# EasyEDA Pro project USB-BD v1.4_2025-09-03.epro

# Schematic 1.4
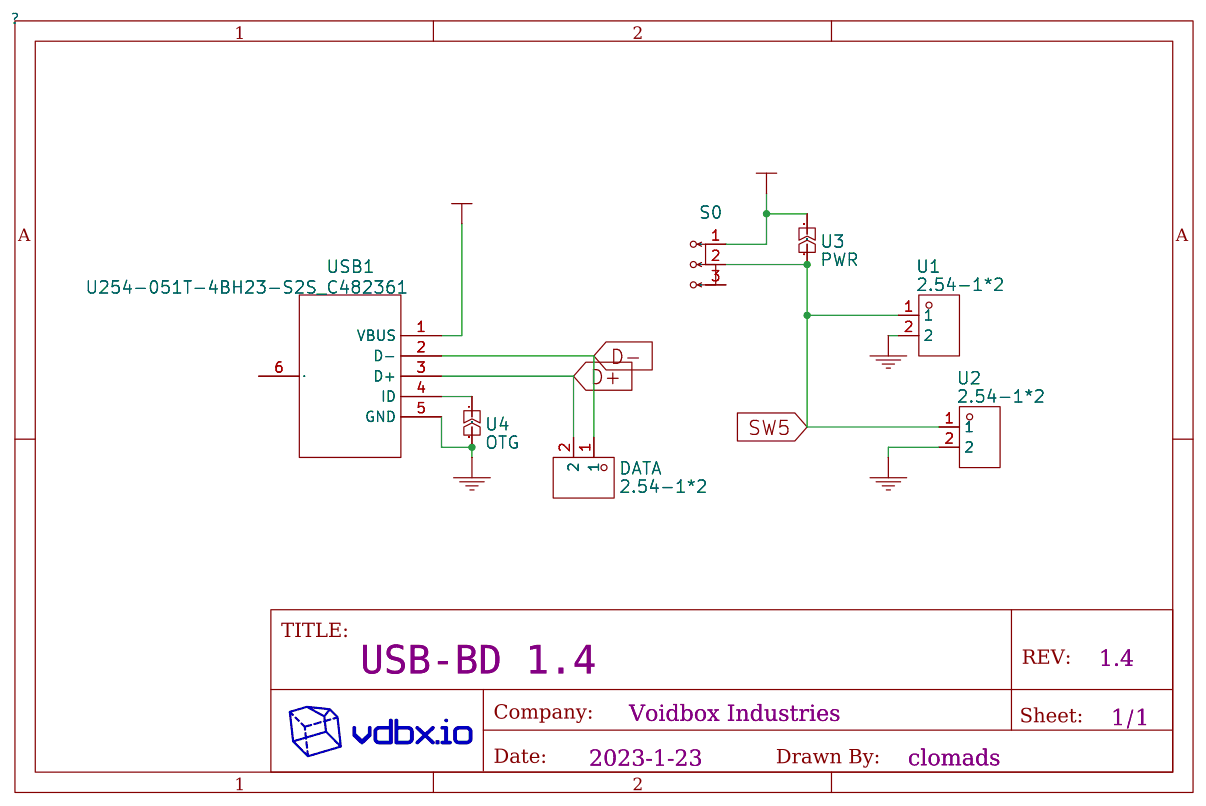
[diagram p0: schematic sheet]

## Parts
DATA  2.54-1*2  [HDR-TH_2P-P2.54-V-M]
S0  Switch  [SW-TH_DEALON_SS-12D01-GX]
U1  2.54-1*2  [HDR-TH_2P-P2.54-V-M]
U2  2.54-1*2  [HDR-TH_2P-P2.54-V-M]
U3  PWR  [JMP_ARROW_2PIN]
U4  OTG  [JMP_ARROW_2PIN]
USB1  U254-051T-4BH23-S2S_C482361  [MICRO-USB-SMD_U254-051T-4BH23-S2S]

## Library data of the parts
DATA U1 U2 = 2.54-1*2: link: https://atta.szlcsc.com/upload/public/pdf/source/20220729/DF18AADA08AA3A4F1D3B0508BB8F7248.pdf; 3DModel: HDR2.54-M-LI-1X2P; Supplier: LCSC; Supplier Part: C5116481; Manufacturer: ZHOURI(洲日); JLCPCB Part Class: Extended Part
S0 = Switch: link: https://atta.szlcsc.com/upload/public/pdf/source/20220425/25A884465C8B20C5829C01117852840B.pdf; Supplier: LCSC; Supplier Part: C2998804; Manufacturer: DEALON(德艺隆); Manufacturer Part: SS-12D01-G4; JLCPCB Part Class: Extended Part
U3 = PWR: Manufacturer Part: SOLDERING JUMPER
U4 = OTG: Manufacturer Part: SOLDERING JUMPER
USB1 = U254-051T-4BH23-S2S_C482361: link: https://item.szlcsc.com/490287.html; Supplier: LCSC; Supplier Part: C482361; Manufacturer: XKB Connectivity(中国星坤); Manufacturer Part: U254-051T-4BH23-S2S; JLCPCB Part Class: Extended Part

## Nets
+5V: S0.1 U3.1 USB1.1(VBUS)
GND: U1.2 U2.2 U4.2 USB1.5(GND)
D+: DATA.2 USB1.3(D+)
D-: DATA.1 USB1.2(D-)
SW5: S0.2 U1.1 U2.1 U3.2
Net-(U4-1): U4.1 USB1.4(ID)

Not connected (* = marked no-connect by the designer): S0 3; USB1 6(EH)

# Schematic USB-BD OG
Board Name: USB-BD OG; Create Date: 2023-01-23; Page Name: VDBX//USB-BD copy; Project Name: USB-BD 2023.2; Schematic Name: USB-BD OG; Update Date: 2023-01-23; Add into BOM: yes; Convert to PCB: yes; Date: 2018-04-12; Draw By: clomads; REV: 1.0a; Sheet: 1/1
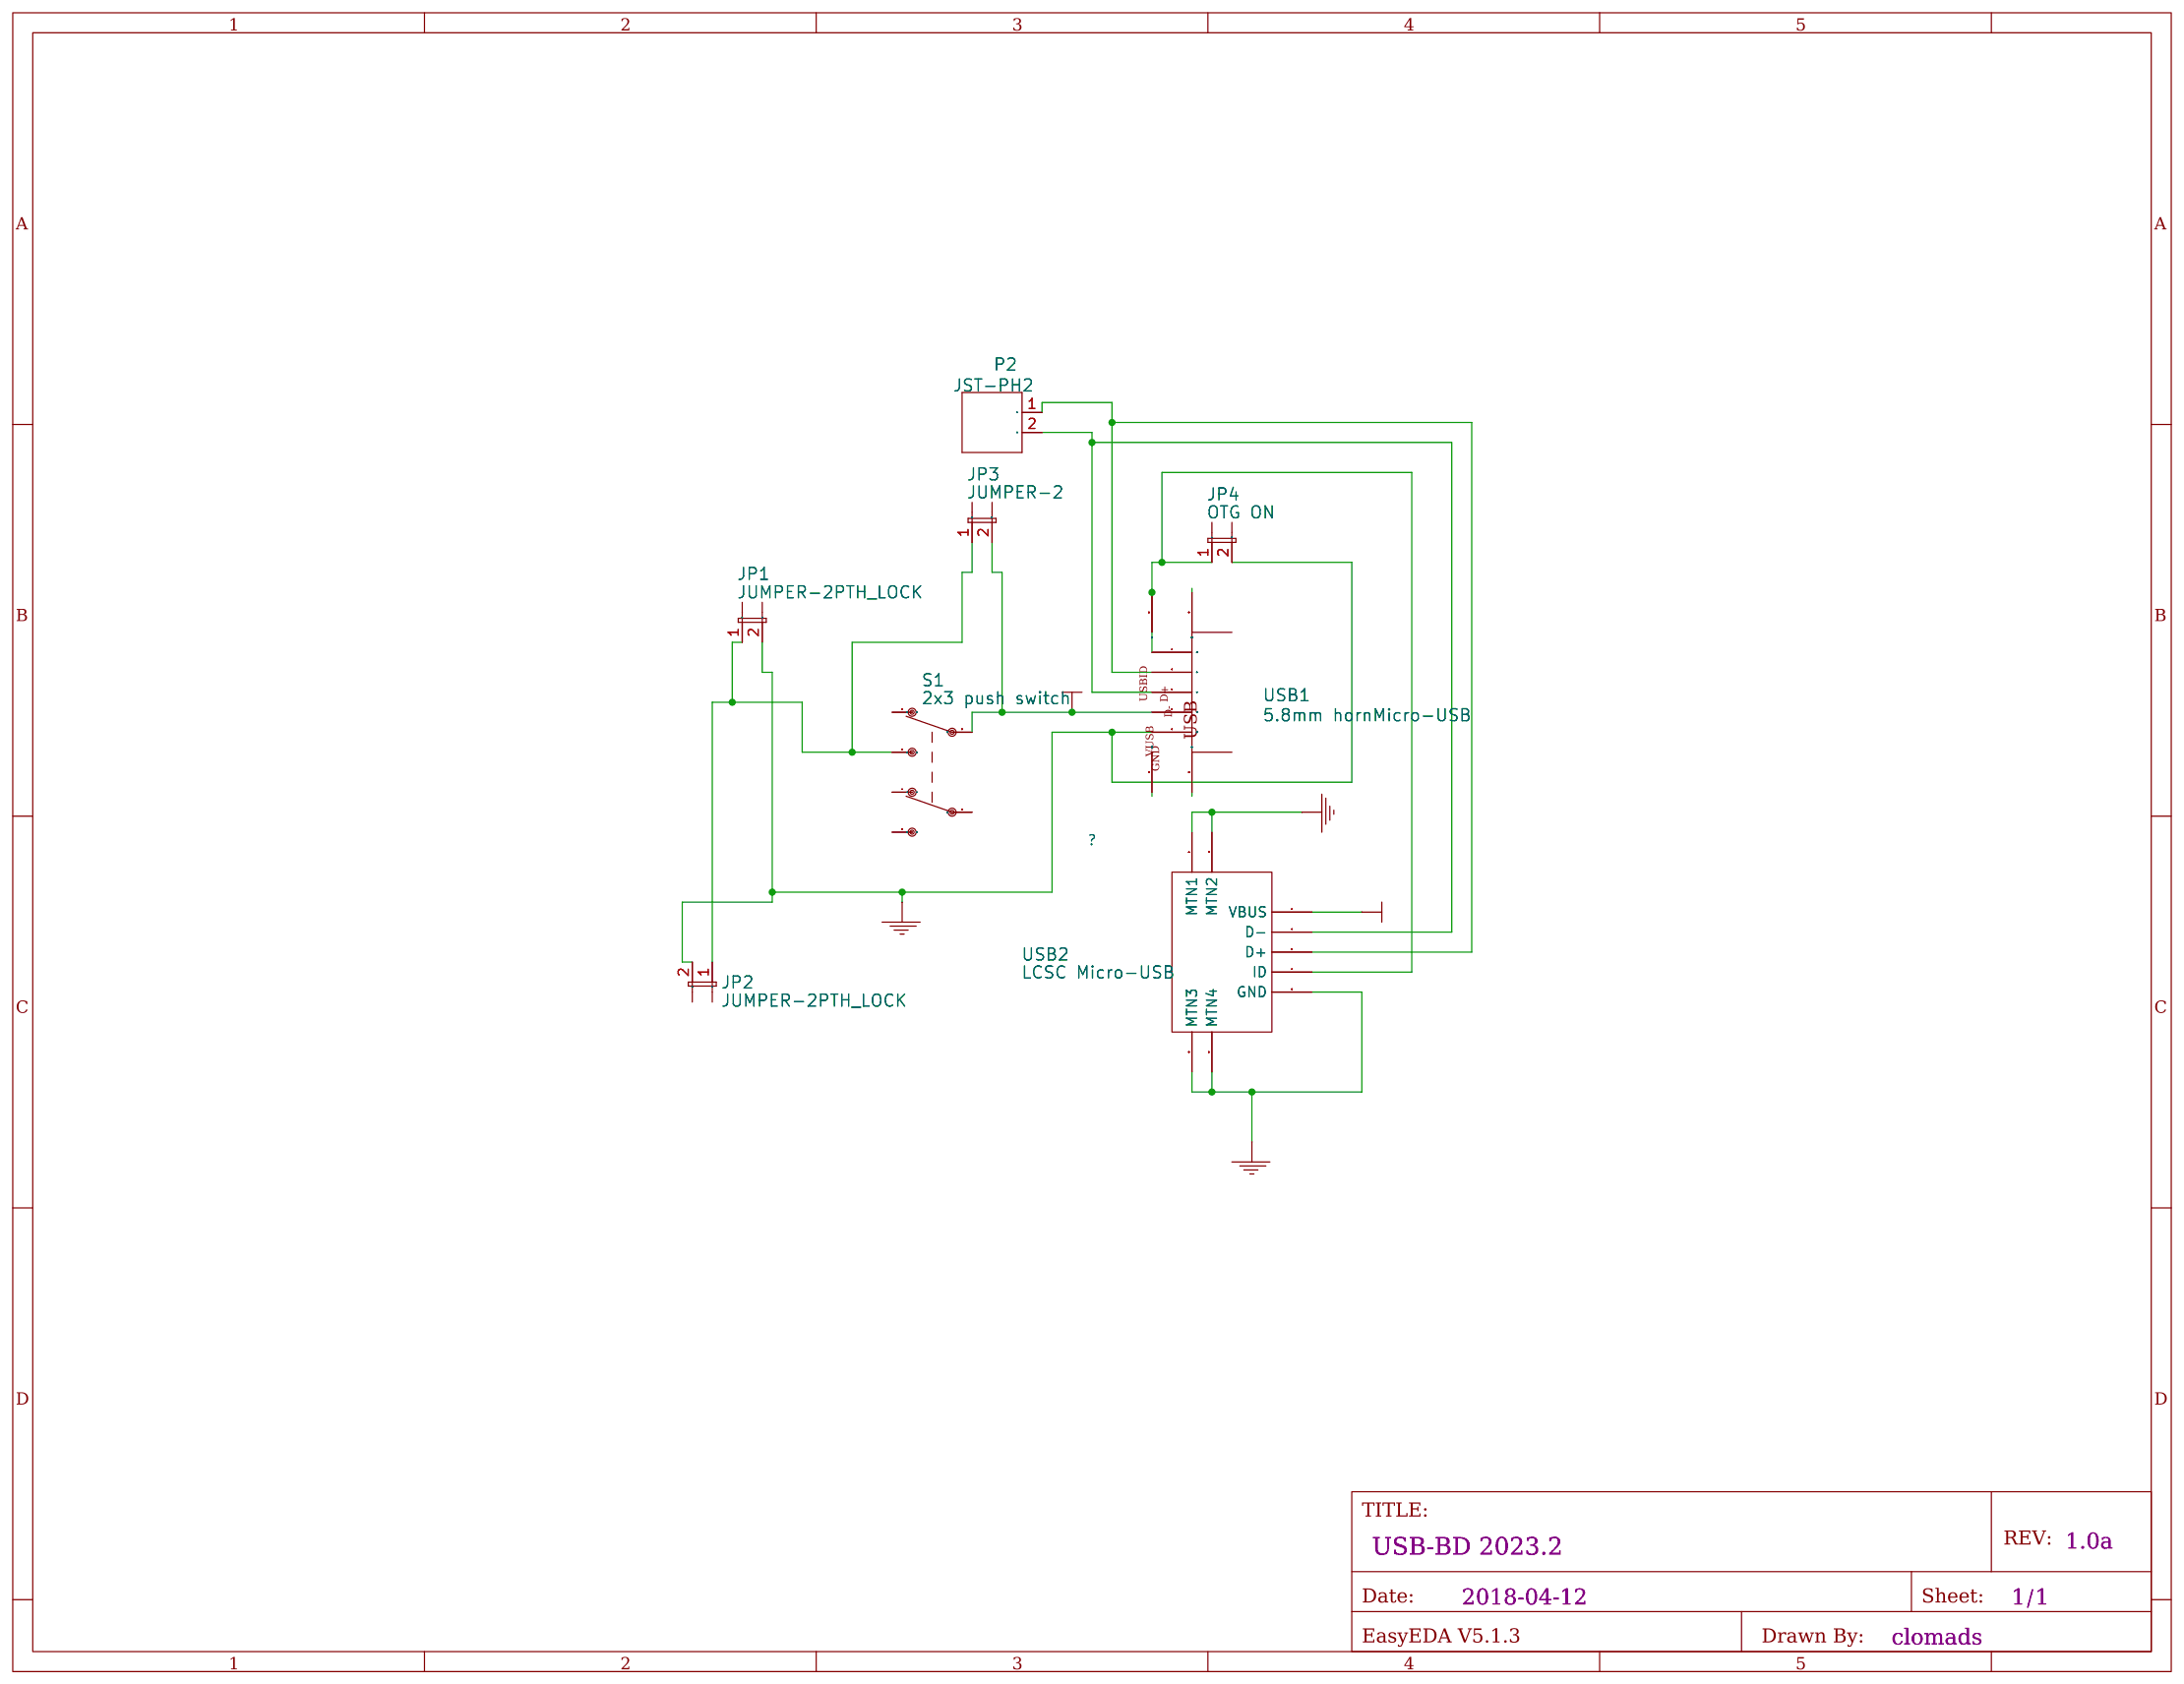
[diagram p1: schematic sheet]

## Parts
JP1  JUMPER-2PTH_LOCK  [1X02_LOCK]
JP2  JUMPER-2PTH_LOCK  [1X02_LOCK]
JP3  JUMPER-2  [JUMPER-2P]
JP4  OTG ON  [JUMPER-2P]
P2  JST-PH2  [JST-2.0-REVERSE POLARITY]
S1  2x3 push switch  [2X3 5.8MM PUSH TACT]
USB1  5.8mm hornMicro-USB  [MICRO USB 5.9]
USB2  LCSC Micro-USB

## Library data of the parts
JP1-JP4 P2 S1 USB1 = ?
USB2 = micro USBFemale: Supplier: LCSC; Manufacturer: ValuePro; image: //image.lceda.cn/szlcsc/C10418.jpg; Supplier Part: C10418

## Nets
+5V: JP3.2 S1.3 USB1.1(VUSB) USB2.1(VBUS)
GND: JP1.2 JP2.2 JP4.1 JP4.2 USB1.0(BODY) USB1.4(USBID) USB1.5(GND) USB2.0(MTN1) USB2.4(ID) USB2.5(GND)
Net-(P2-1): P2.1 USB1.3(D+) USB2.3(D+)
Net-(P2-2): P2.2 USB1.2(D-) USB2.2(D-)
S1_2: JP1.1 JP2.1 JP3.1 S1.2

Not connected (* = marked no-connect by the designer): S1 1 4 5 6

# Board 1.4
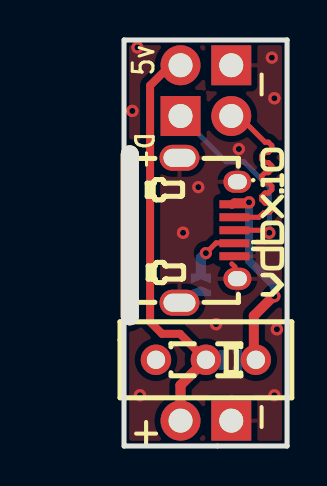
[diagram p2: board, top side]
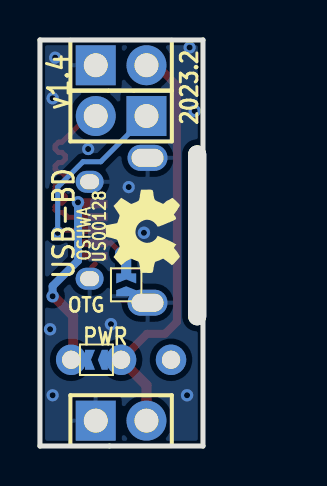
[diagram p3: board, bottom side, seen from below]

Outline 8.16 x 20.31 mm; copper layers: Top Layer, Bottom Layer. Coordinates in mm from the lower left corner of the outline.
Outline path: 0,20.31 8.16,20.31 8.16,0 0,0 0,20.31
Stack: Top Layer 0.035mm / Dielectric1 1.51mm FR4 er 4.5 / Bottom Layer 0.035mm

## Design rules (mm)
spacing Default (default): track to track 0.152, other pairs 0 to 0.152
track width Default (default): min 0.152, default 0.152, max 25.4
differential pair differentialPair (default): width min 0.127, default 0.254, max 2.54; gap min 0.152, default 0.152
via Default (default): diameter min 0.6, default 0.6, max 100.025; hole min 0.3, default 0.3, max 59.995
net GND uses (1)
pour e71 uses (1)

## Placement (name value [footprint] x y rotation side)
D+  2.54-1*2  [HDR-TH_2P-P2.54-V-M]  4.1 16.51 180 bottom
NOREF  -  [Pad_e158]  0.29 10.54 0 top
OTG  OTG  [JMP_ARROW_2PIN]  3.85 8.13 270 bottom
S0  Switch  [SW-TH_DEALON_SS-12D01-GX]  4.1 4.31 180 top
U1  2.54-1*2  [HDR-TH_2P-P2.54-V-M]  4.1 1.27 0 bottom
U2  2.54-1*2  [HDR-TH_2P-P2.54-V-M]  4.1 19.05 0 bottom
U3  PWR  [JMP_ARROW_2PIN]  5.4 4.31 180 bottom
USB1  U254-051T-4BH23-S2S_C482361  [MICRO-USB-SMD_U254-051T-4BH23-S2S]  4.23 10.8 270 top

## Footprints (pads in the part's own frame, mm; a bottom-side part is the same pattern mirrored in y, then rotated)
HDR-TH_2P-P2.54-V-M
  round 2 hole 1.2: 1(-1.27,0)
  rect 2x2 hole 1.2: 2(1.27,0)
JMP_ARROW_2PIN
  custom 0.5x1 smd: 1(-0.508,0) 2(0.635,0)
MICRO-USB-SMD_U254-051T-4BH23-S2S
  rect 0.4x1.5 smd: 1(-1.3,1.3) 2(-0.65,1.3) 3(0,1.3) 4(0.65,1.3) 5(1.3,1.3)
  oval 1.1x1.4 hole 0.75x0.95: 6(2.425,1.45) 7(-2.425,1.45)
  oval 1.3x2 hole 0.9x1.6: 8(3.624,-1.45) 9(-3.624,-1.45)
Pad_e158
  oval 0.9x9 hole 0.9x9: 24(0,0)
SW-TH_DEALON_SS-12D01-GX
  round 1.524 hole 0.914: 1(-2.5,0) 2(-0.001,0) 3(2.5,0)

## Nets
+5V: S0.1 U3.1 USB1.1
GND: OTG.2 U1.2 U2.2 USB1.5 USB1.6 USB1.7 USB1.8 USB1.9
D+: D+.2 USB1.3
D-: D+.1 USB1.2
S0_3: S0.3
SW5: S0.2 U1.1 U2.1 U3.2
USB1_4: OTG.1 USB1.4

Pads without a net: NOREF 24

## Via types
v1: diameter 0.61, hole 0.305, Top Layer to Bottom Layer, 6 vias
v2: diameter 0.62, hole 0.305, Top Layer to Bottom Layer, 9 vias

## Routing (per net, layer and track width the routed paths; a pad name or vN(x,y) marks a point on that pad's centre or on a via; arc(x,y) is an arc through that point)
+5V: length 9.8
  Top Layer w0.4: 5.4,12.06 5.53,12.19 v2(6.26,12.19)
  Top Layer w0.5: v2(7.53,7.49) 7.48,7.49 6.5,6.51 6.5,4.41 S0.1
  Bottom Layer w0.4: v2(7.53,7.49) 7.53,8 6.26,9.27 v2(6.26,12.19)
GND: length 0.9
  Top Layer w0.254: 5.55,8.24 5.55,8.96 5.4,9.11
  vias: v1(0.67,19.94) v1(3.72,12.95) v1(5.75,14.86) v1(7.4,19.43) v1(7.53,2.54) v2(0.42,16.76) v2(0.8,2.54) v2(2.96,10.67) v2(4.61,6.1) v2(7.53,17.4) v2(7.66,5.84)
D+: length 10.1
  Top Layer w0.254: v2(7.27,10.67) 7.15,10.8 5.4,10.8
  Bottom Layer w0.254: D+.2 5.12,14.22 6,14.22 7.27,12.95 v2(7.27,10.67)
D-: length 9.9
  Top Layer w0.254: D+.1 5.75,16.51 7.06,15.2 7.23,15.2 7.4,15.03 7.4,14.86 7.23,14.69 7.06,14.69 6.89,14.52 6.89,14.35 7.06,14.18 7.23,14.18 7.4,14.02 7.4,13.85 7.23,13.68 7.06,13.68 6.89,13.51 6.89,13.34 7.06,13.17 7.23,13.17 7.4,13 7.4,12.83 7.23,12.66 7.06,12.66 6.89,12.49 6.89,12.32 7.06,12.15 7.23,12.15 7.4,11.98 7.4,11.81 7.27,11.68 7.02,11.68 6.75,11.45 5.4,11.45
SW5: length 20.9
  Top Layer w0.4: S0.2 2.8,5.61 1.9,5.62 1.31,6.21 1.31,18.03 2.32,19.05 U2.1
  Top Layer w0.508: S0.2 2.83,3.04 U1.1
USB1_4: length 2.6
  Top Layer w0.254: 5.4,10.16 4.61,10.16 v1(4.1,9.65)
  Bottom Layer w0.508: OTG.1 3.85,9.4 v1(4.1,9.65)

## Copper pours and planes (outline as drawn; the poured copper is in the pictures)
GND on Top Layer: 9.18,25.02 -0.84,25.02 -0.84,-3.29 9.18,-3.29
GND on Bottom Layer: 9.4,-4.29 9.23,22.55 5.71,25.33 -0.94,25.01 -1.2,-4.37

## Text on the board
Bottom Silkscreen Layer: US00128 | OSHWA | PWR | 2023.2 | USB-BD | v1.4
Top Silkscreen Layer: 5v | + | -

# Board v1.1
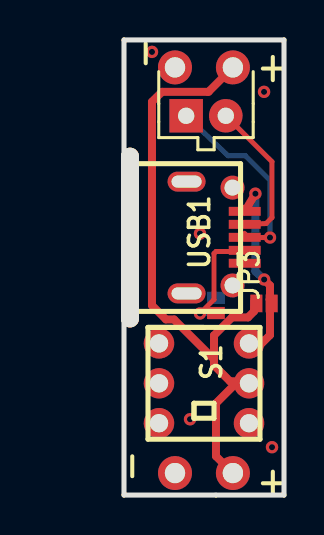
[diagram p4: board, top side]
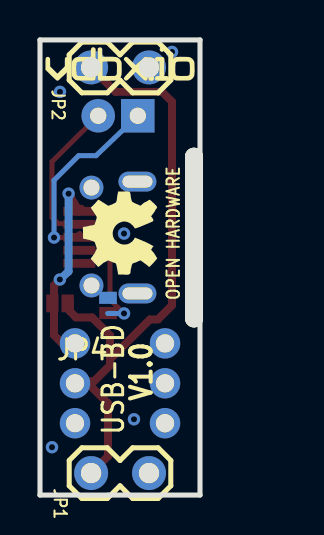
[diagram p5: board, bottom side, seen from below]

Outline 8 x 22.8 mm; copper layers: Top Layer, Bottom Layer. Coordinates in mm from the lower left corner of the outline.
Outline path: 0,22.8 8,22.8 8,0 0,0 0,22.8
Stack: Top Layer 0.035mm / Dielectric1 1.51mm FR4 er 4.5 / Bottom Layer 0.035mm

## Design rules (mm)
spacing Default (default): track to track 0.152, other pairs 0 to 0.152
track width Default (default): min 0.152, default 0.152, max 25.4
differential pair differentialPair (default): width min 0.127, default 0.254, max 2.54; gap min 0.152, default 0.152
via Default (default): diameter min 0.6, default 0.6, max 100.025; hole min 0.3, default 0.3, max 59.995
net GND uses (1)

## Placement (name value [footprint] x y rotation side)
JP1  JUMPER-2PTH_LOCK  [1X02_LOCK]  5.27 1.1 180 bottom
JP2  JUMPER-2PTH_LOCK  [1X02_LOCK]  5.27 21.42 180 bottom
JP3  JUMPER-2  [JUMPER-2P]  7 9.6 90 top
JP4  OTG ON  [JUMPER-2P#2]  4.6 9.5 0 bottom
NOREF  -  [Pad_e109]  0.3 12.9 0 top
P2  JST-PH2  [JST-2.0-REVERSE POLARITY]  4.1 19 0 top
S1  2x3 push switch  [2X3 5.8MM PUSH TACT]  4 5.6 90 top
USB1  5.8mm hornMicro-USB  [MICRO USB 5.9]  5.93 16.6 270 top

## Footprints (pads in the part's own frame, mm; a bottom-side part is the same pattern mirrored in y, then rotated)
1X02_LOCK
  round 1.7 hole 1.016: 1(-0.177,0) 2(2.718,0)
2X3 5.8MM PUSH TACT
  round 1.524 hole 0.91: 1(-1.999,-2.251)
  round 1.524 hole 0.914: 2(0,-2.251) 3(1.999,-2.251) 4(-1.999,2.251) 5(0,2.251) 6(1.999,2.251)
JST-2.0-REVERSE POLARITY
  rect 1.677x1.677 hole 0.813: 1(-0.991,0)
  round 1.677 hole 0.813: 2(0.991,0)
JUMPER-2P
  rect 0.889x0.61 smd: 1(0,0.381) 2(0,-0.381)
JUMPER-2P#2
  rect 0.889x0.61 smd far side: 1(0,0.381)
  rect 0.889x0.61 smd: 2(0,-0.381)
MICRO USB 5.9
  oval 1x1.9 hole 0.6x1.5: 0(0.899,-2.799) 8(6.5,-2.799)
  rect 0.45x1.6 smd: 1(2.389,0.11) 2(3.039,0.11) 3(3.689,0.11) 4(4.34,0.11) 5(4.99,0.11)
  round 1.2 hole 0.8: 6(1.199,-0.5) 7(6.101,-0.5)
Pad_e109
  oval 0.9x9 hole 0.914x9: 24(0,0)

## Nets
+5V: JP3.2 S1.3 USB1.1
GND: JP1.2 JP2.2 JP4.2 USB1.0 USB1.5 USB1.6 USB1.7 USB1.8
BODY: JP4.1 USB1.4
S1_1: S1.1
S1_2: JP1.1 JP2.1 JP3.1 S1.2
S1_4: S1.4
S1_5: S1.5
S1_6: S1.6
USB1_2: P2.2 USB1.2
USB1_3: P2.1 USB1.3

Pads without a net: NOREF 24

## Via types
v1: diameter 0.62, hole 0.305, Top Layer to Bottom Layer, 9 vias

## Routing (per net, layer and track width the routed paths; a pad name or vN(x,y) marks a point on that pad's centre or on a via; arc(x,y) is an arc through that point)
+5V: length 9.2
  Top Layer w0.254: 5.91,14.41 6.02,14.41 6.01,14.36
  Top Layer w0.4: v1(7.01,10.8) 7.01,10.79 7.3,10.5 7.3,9.82 7.28,9.8 ; v1(6.57,15.1) USB1.1 ; 7.3,9.8 7.3,8.01 6.88,7.59
  Bottom Layer w0.4: 6.57,15.1 6.57,11.2 7.01,10.8
GND:
  vias: v1(1.4,22.2) v1(3.3,3.8) v1(3.8,13.1) v1(7,20.2) v1(7.4,2.4)
BODY: length 5.4
  Top Layer w0.25: 5.7,12.2 4.6,12.2 4.5,12.1 4.5,9.8 v1(3.8,9.1)
  Bottom Layer w0.25: 4.62,9.1 v1(3.8,9.1)
S1_2: length 31.7
  Top Layer w0.4: 6.52,9.8 6.5,9.2 6.2,8.9 5.4,8.9 4.5,8 4.5,6.5 5.3,5.7 6.15,5.7 6.25,5.6 5.6,5.6 4.6,4.6 4.6,1.95 JP1.1 ; 4.42,6.87 2.5,8.8 2.1,8.8 1.4,9.5 1.4,19.7 1.9,20.2 4.22,20.2 JP2.1
USB1_2: length 7.5
  Top Layer w0.25: P2.2 7.4,16.7 7.4,13.9 7.1,13.6 USB1.2
USB1_3: length 9.7
  Top Layer w0.254: 6.02,13.11 6.23,12.9 v1(7.3,12.9)
  Bottom Layer w0.254: v1(7.3,12.9) 7.3,15.77 6.07,17 5.2,17 P2.1

## Text on the board
Bottom Silkscreen Layer: OPEN HARDWARE | USB-BD | V1.0
Top Silkscreen Layer: + | -
